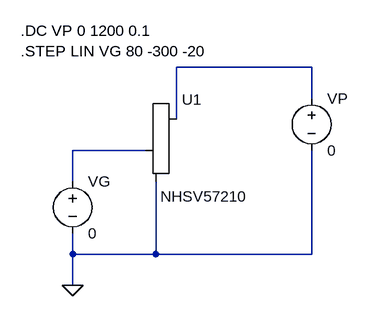
[diagram p0: schematic Triode Plate Characteristics.asc]
Triode Plate Characteristics.asc, the LTspice schematic file:
Version 4
SHEET 1 880 680
WIRE -144 96 -352 96
WIRE -144 144 -144 96
WIRE -352 176 -352 96
WIRE -400 224 -512 224
WIRE -512 272 -512 224
WIRE -512 384 -512 352
WIRE -384 384 -384 272
WIRE -384 384 -512 384
WIRE -144 384 -144 224
WIRE -144 384 -384 384
WIRE -512 432 -512 384
FLAG -512 432 0
SYMBOL voltage -144 128 R0
SYMATTR InstName VP
SYMATTR Value 0
SYMBOL voltage -512 256 R0
WINDOW 123 0 0 Left 0
WINDOW 39 0 0 Left 0
SYMATTR InstName VG
SYMATTR Value 0
SYMBOL Valve\\triode -352 224 R0
WINDOW 38 42 71 Center 0
SYMATTR SpiceModel NHSV57210
SYMATTR InstName U1
TEXT -592 40 Left 0 !.DC VP 0 1200 0.1\n.STEP LIN VG 80 -300 -20

The netlist it stands for:
* Triode Plate Characteristics.asc
VP N001 0 0
VG N002 0 0
XU1 N001 N002 0 NHSV57210
.DC VP 0 1200 0.1
.STEP LIN VG 80 -300 -20
.backanno
.end